# EAGLE design Flip Flop (EAGLE 9.5.0)
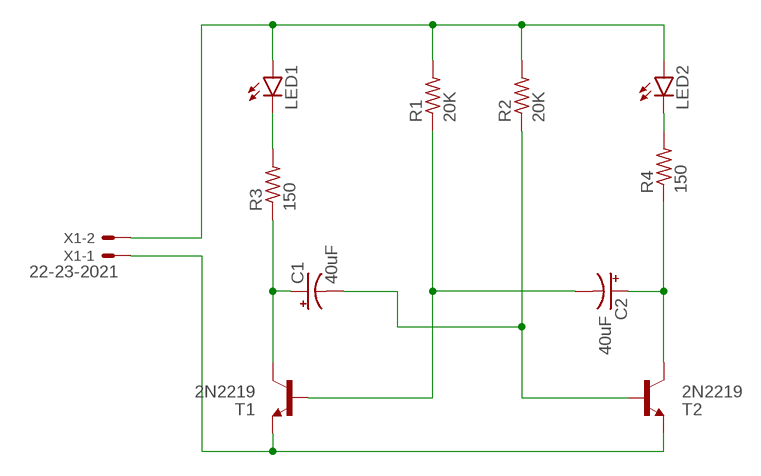
[diagram p0: schematic, sheet 1]

## Parts
C1  40uF  CPOL-USE2.5-6  [E2,5-6]
C2  40uF  CPOL-USE2.5-6  [E2,5-6]
LED1  LED5MM  [LED5MM]
LED2  LED5MM  [LED5MM]
R1  20K  R-US_0207/10  [0207/10]
R2  20K  R-US_0207/10  [0207/10]
R3  150  R-US_0207/10  [0207/10]
R4  150  R-US_0207/10  [0207/10]
T1  2N2219  [TO5]
T2  2N2219  [TO5]
X1  22-23-2021  [22-23-2021]

## Nets
GND: T1.1(E) T2.1(E) X1.1
N$1: LED1.K(C) R3.2
N$2: LED2.K(C) R4.2
N$3: C1.+ R3.1 T1.3(C)
N$4: C2.+ R4.1 T2.3(C)
N$5: C2.- R1.1 T1.2(B)
N$6: C1.- R2.1 T2.2(B)
N$9: LED1.A LED2.A R1.2 R2.2 X1.2

## Library data of the parts
C1 C2 = rcl:CPOL-US: POLARIZED CAPACITOR, American symbol; SPICEPREFIX: C
LED1 LED2 = led:LED: LED OSRAM: - CHIPLED LG R971, LG N971, LY N971, LG Q971, LY Q971, LO R971, LY R971 LH N974, LH R974 LS Q976, LO Q976, LY Q976 LO Q996 - Hyper CHIPLED LW Q18S LB Q993, LB Q99A, LB R99A - SideLED LS A670, LO A670, LY A670, LG A670, LP A670 LB A673, LV A673, LT A673, LW A673 LH A674 LY A675 LS A676, LA A676, LO A676, LY A676, LW A676 LS A679, LY A679, LG A679 - Hyper Micro SIDELED® LS Y876, LA Y876, LO Y876, LY Y876 LT Y87S - SmartLED LW L88C, LW L88S LB L89C, LB L89S, LG L890 LS L89K, LO L89K, LY L89K LS L896, LA L896, LO L896, LY L896 - TOPLED LS T670, LO T670, LY T670, LG T670, LP T670 LSG T670, LSP T670, LSY T670, LOP T670, LYG T670 LG T671, LOG T671, LSG T671 LB T673, LV T673, LT T673, LW T673 LH T674 LS T676, LA T676, LO T676, LY T676, LB T676, LH T676, LSB T676, LW T676 LB T67C, LV T67C, LT T67C, LS T67K, LO T67K, LY T67K, LW E67C LS E67B, LA E67B, LO E67B, LY E67B, LB E67C, LV E67C, LT E67C LW T67C LS T679, LY T679, LG T679 LS T770, LO T770, LY T770, LG T770, LP T770 LB T773, LV T773, LT T773, LW T773 LH T774 LS E675, LA E675, LY E675, LS T675 LS T776, LA T776, LO T776, LY T776, LB T776 LHGB T686 LT T68C, LB T68C - Hyper Mini TOPLED® LB M676 - Mini TOPLED Santana® LG M470 LS M47K, LO M47K, LY M47K Source: http://www.osram.convergy.de LUXEON: - LUMILED® LXK2-PW12-R00, LXK2-PW12-S00, LXK2-PW14-U00, LXK2-PW14-V00 LXK2-PM12-R00, LXK2-PM12-S00, LXK2-PM14-U00 LXK2-PE12-Q00, LXK2-PE12-R00, LXK2-PE12-S00, LXK2-PE14-T00, LXK2-PE14-U00 LXK2-PB12-K00, LXK2-PB12-L00, LXK2-PB12-M00, LXK2-PB14-N00, LXK2-PB14-P00, LXK2-PB14-Q00 LXK2-PR12-L00, LXK2-PR12-M00, LXK2-PR14-Q00, LXK2-PR14-R00 LXK2-PD12-Q00, LXK2-PD12-R00, LXK2-PD12-S00 LXK2-PH12-R00, LXK2-PH12-S00 LXK2-PL12-P00, LXK2-PL12-Q00, LXK2-PL12-R00 Source: www.luxeon.com KINGBRIGHT: KA-3528ASYC Source: www.kingbright.com
R1-R4 = rcl:R-US_: RESISTOR, American symbol; SPICEPREFIX: R
T1 T2 = transistor:2N2219: NPN TRANSISTOR
X1 = con-molex:22-23-2021: .100" (2.54mm) Center Header - 2 Pin; MF: MOLEX; MPN: 22-23-2021; OC_FARNELL: 1462926; OC_NEWARK: 25C3832

## Board
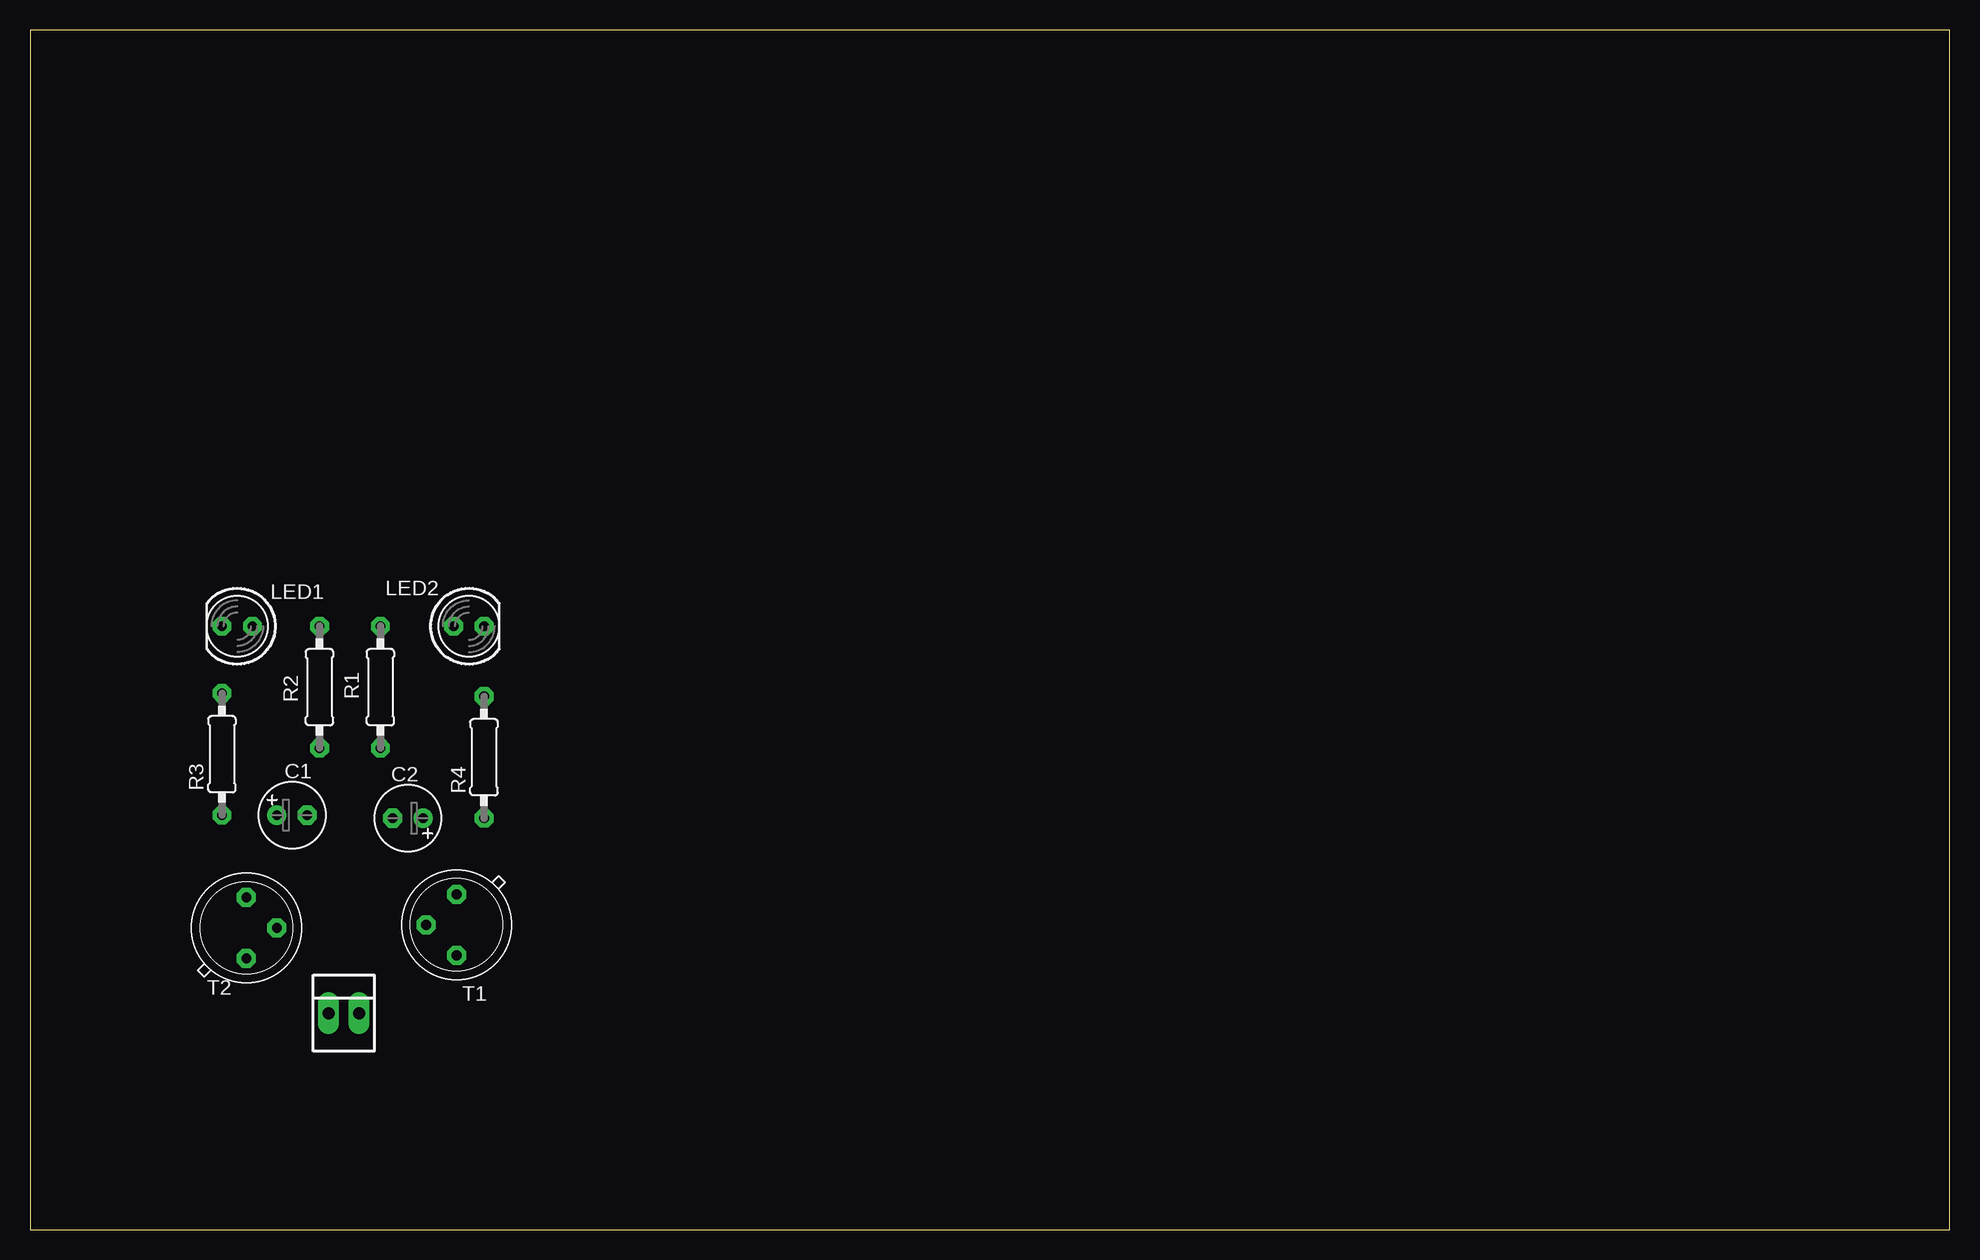
[diagram p1: board, top side]
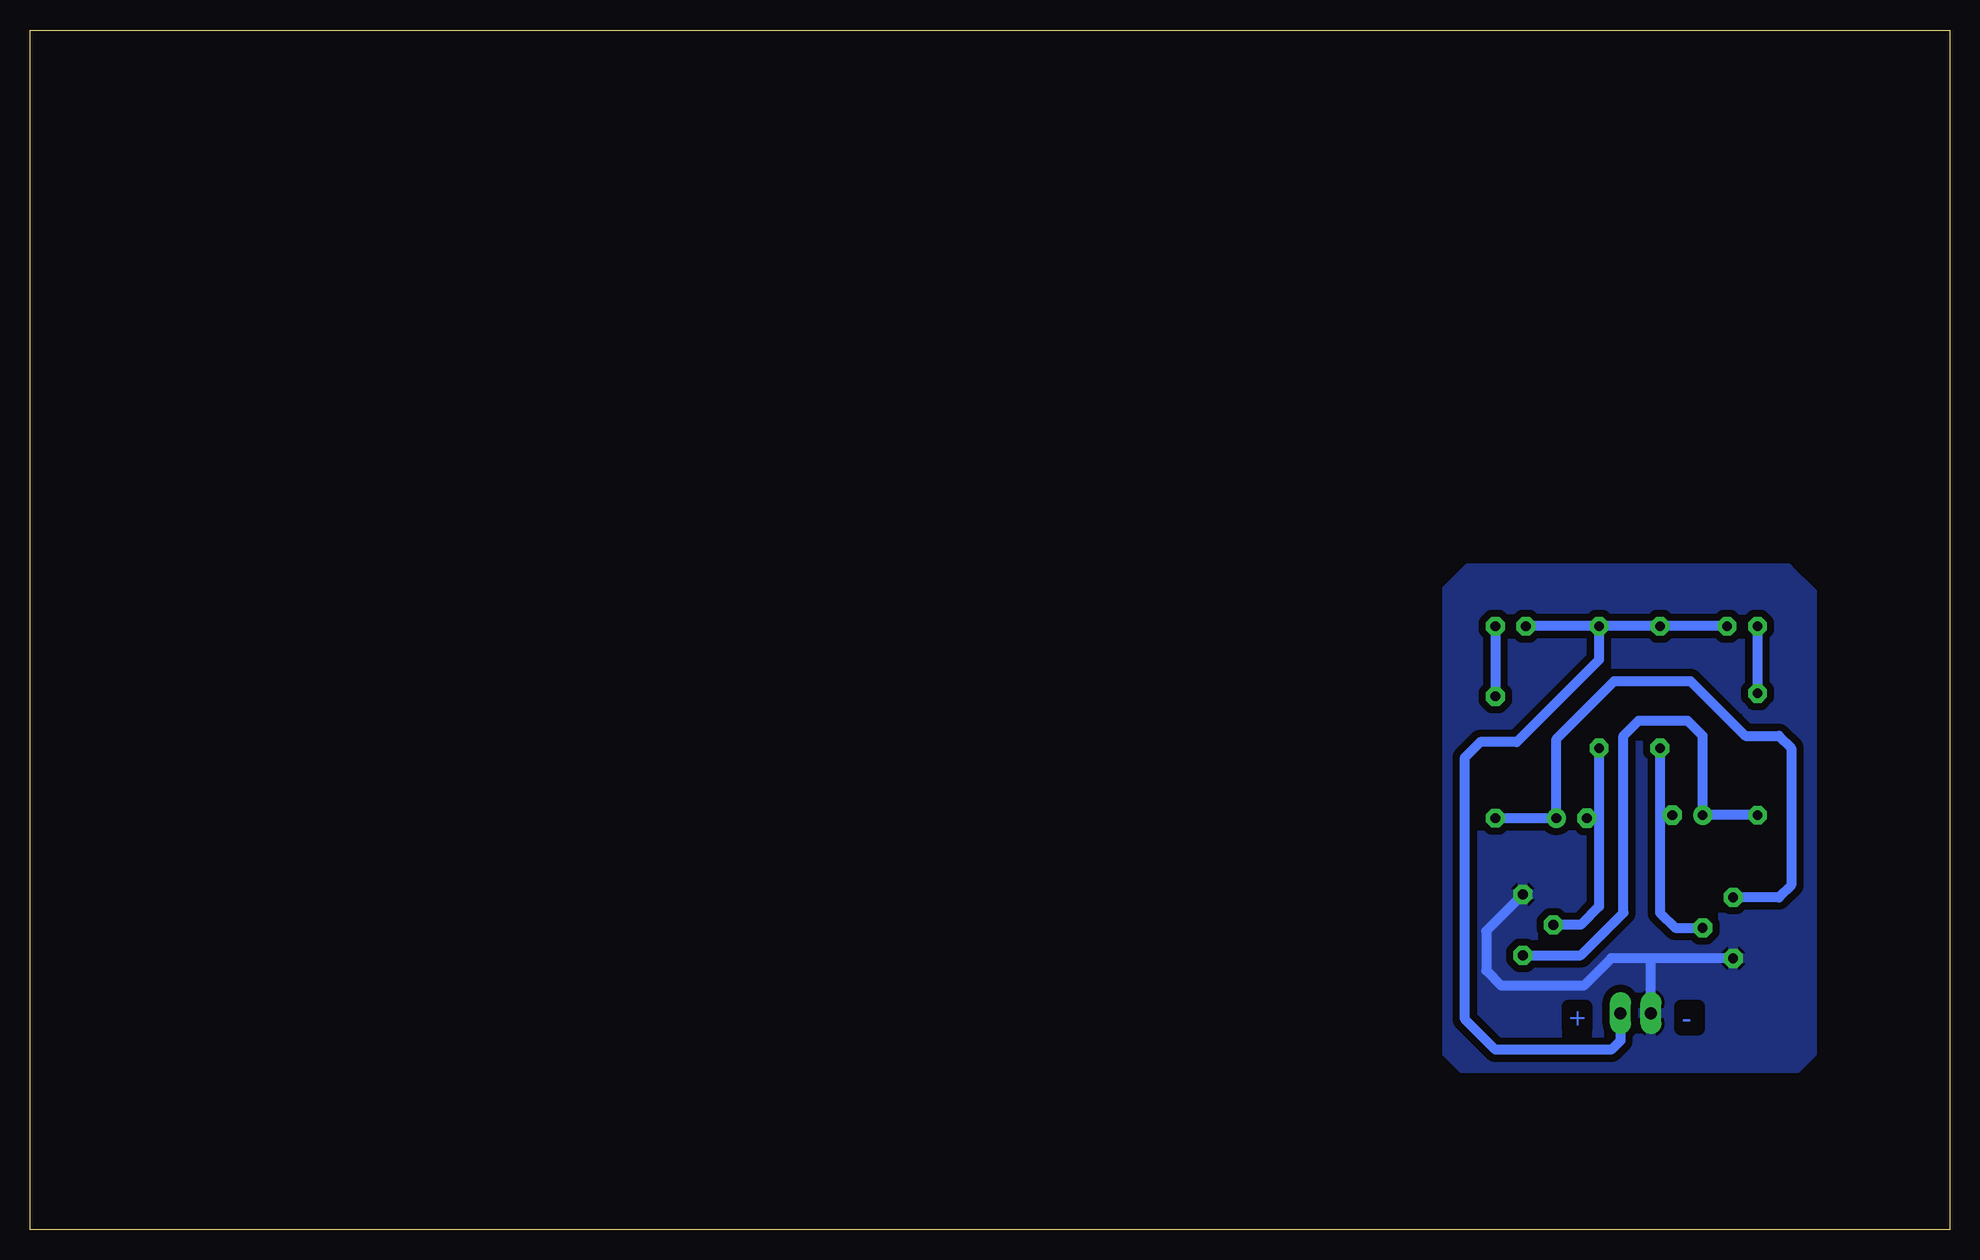
[diagram p2: board, bottom side, seen from below]

Size 160 x 100 mm. Coordinates in mm from the lower left corner, seen from the top.
Outline: 0,0 160,0 160,100 0,100 0,0
Copper layers (1*16): Top 0.035mm / dielectric 1.5mm / Bottom 0.035mm
Design rules "default *": minimum track width 6mil, minimum drill 0.35mm, track to track 24mil, track to pad 24mil, pad to pad 24mil, via to via 24mil, smd to smd 24mil, copper to edge 40mil, drill to drill 6mil, minimum pad ring 15mil, minimum via ring 8mil, stop-mask expansion 2.4mm, vias tented up to drill 0mil, thermal gap 10mil

### Footprints (pad centres in the part's own frame; a part is rotated, then mirrored left to right if it is on the bottom)
E2,5-6 = drill 0.813 pad 1.6: + -1.27,0 | drill 0.813 pad 1.6 octagon: - 1.27,0
LED5MM = drill 0.813 octagon: A -1.27,0; K 1.27,0
0207/10 = drill 0.813 octagon: 1 -5.08,0; 2 5.08,0
TO5 = drill 0.813 octagon: 1 0,-2.54; 2 2.54,0; 3 0,2.54
22-23-2021 = drill 1 long: 1 -1.27,0; 2 1.27,0

### Placement (x,y rotation side)
C1  21.84,34.54 0 top
C2  31.5,34.29 180 top
LED1  17.27,50.29 180 top
LED2  36.58,50.29 0 top
R1  29.21,45.21 90 top
R2  24.13,45.21 90 top
R3  16,39.62 90 top
R4  37.85,39.37 90 top
T1  35.56,25.4 180 top
T2  18.03,25.15 0 top
X1  26.16,18.03 0 top

### Tracks (layer width: path | path; a pad name or v marks a point on that pad's centre or on a via)
GND
  Bottom 0.813: T1.1 38.61,24.89 38.61,21.59 37.34,20.32 30.48,20.32 28.19,22.61 25.15,22.61 | T2.1 25.15,22.61 | X1.1 24.89,22.35 25.15,22.61
  pour Bottom: 40.13,55.12 41.91,53.34 41.91,14.73 40.64,13.46 12.7,13.46 11.43,14.73 11.43,53.09 13.46,55.12
N$1
  Bottom 0.813: LED1.K R3.2
N$2
  Bottom 0.813: LED2.K R4.2
N$3
  Bottom 0.813: R3.1 C1.+ 20.57,41.15 21.84,42.42 25.91,42.42 27.18,41.15 27.18,26.42 30.73,22.86 T1.3
N$4
  Bottom 0.813: R4.1 C2.+ 32.77,40.89 27.94,45.72 21.59,45.72 17.02,41.15 14.22,41.15 13.21,40.13 13.21,28.7 14.22,27.69 T2.3
N$5
  Bottom 0.813: R1.1 29.21,34.29 | 29.21,34.29 29.21,26.92 30.73,25.4 T1.2 | C2.- 29.21,34.29
N$6
  Bottom 0.813: R2.1 24.13,34.54 | 24.13,34.54 24.13,26.42 22.86,25.15 T2.2 | C1.- 24.13,34.54
N$9
  Bottom 0.813: LED1.A R2.2 R1.2 | R1.2 LED2.A | R1.2 29.21,47.5 36.07,40.64 39.12,40.64 40.39,39.37 40.39,17.53 37.85,14.99 28.19,14.99 27.43,15.75 X1.2

### Text on the board
Bottom: - | +